# EAGLE schematic ICeePotTransmitter (EAGLE 6.3)
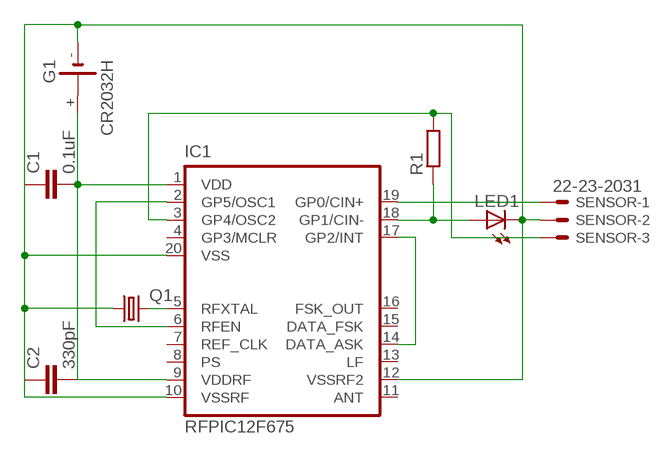
[diagram p0: schematic, sheet 1]

## Parts
C1  0.1uF  C-EUC0603K  [C0603K]
C2  330pF  C-EUC0603K  [C0603K]
G1  CR2032H  [CR2032H]
IC1  RFPIC12F675  [SOIC20]
LED1  LED5MM  [LED5MM]
Q1  CRYSTALHC49S  [HC49/S]
R1  R-EU_0204/7  [0204/7]
SENSOR  22-23-2031  [22-23-2031]

## Nets
N$1: IC1.19(GP0/CIN+) SENSOR.1
N$2: IC1.14(DATA_ASK) IC1.17(GP2/INT)
N$3: IC1.18(GP1/CIN-) LED1.A R1.1
N$4: IC1.3(GP4/OSC2) R1.2 SENSOR.3
N$5: C1.2 C2.2 G1.+ IC1.1(VDD) IC1.9(VDDRF)
N$6: IC1.5(RFXTAL) Q1.2
N$7: C1.1 C2.1 G1.- IC1.10(VSSRF) IC1.12(VSSRF2) IC1.20(VSS) LED1.K(C) Q1.1 SENSOR.2
N$8: IC1.2(GP5/OSC1) IC1.6(RFEN)
Unconnected: G1.+@1(+) IC1.4(GP3/MCLR) IC1.7(REF_CLK) IC1.8(PS) IC1.11(ANT) IC1.13(LF) IC1.15(DATA_FSK) IC1.16(FSK_OUT)

## Library data of the parts
C1 C2 = rcl:C-EU: CAPACITOR, European symbol
G1 = battery:CR2032H: LI BATTERY Varta
IC1 = rfpic:RFPIC12F675: Microchip 12F675 PIC Microcontroller with rf transmitter
LED1 = adafruit:LED: LED OSRAM: - CHIPLED LG R971, LG N971, LY N971, LG Q971, LY Q971, LO R971, LY R971 LH N974, LH R974 LS Q976, LO Q976, LY Q976 LO Q996 - Hyper CHIPLED LW Q18S LB Q993, LB Q99A, LB R99A - SideLED LS A670, LO A670, LY A670, LG A670, LP A670 LB A673, LV A673, LT A673, LW A673 LH A674 LY A675 LS A676, LA A676, LO A676, LY A676, LW A676 LS A679, LY A679, LG A679 - Hyper Micro SIDELED® LS Y876, LA Y876, LO Y876, LY Y876 LT Y87S - SmartLED LW L88C, LW L88S LB L89C, LB L89S, LG L890 LS L89K, LO L89K, LY L89K LS L896, LA L896, LO L896, LY L896 - TOPLED LS T670, LO T670, LY T670, LG T670, LP T670 LSG T670, LSP T670, LSY T670, LOP T670, LYG T670 LG T671, LOG T671, LSG T671 LB T673, LV T673, LT T673, LW T673 LH T674 LS T676, LA T676, LO T676, LY T676, LB T676, LH T676, LSB T676, LW T676 LB T67C, LV T67C, LT T67C, LS T67K, LO T67K, LY T67K, LW E67C LS E67B, LA E67B, LO E67B, LY E67B, LB E67C, LV E67C, LT E67C LW T67C LS T679, LY T679, LG T679 LS T770, LO T770, LY T770, LG T770, LP T770 LB T773, LV T773, LT T773, LW T773 LH T774 LS E675, LA E675, LY E675, LS T675 LS T776, LA T776, LO T776, LY T776, LB T776 LHGB T686 LT T68C, LB T68C - Hyper Mini TOPLED® LB M676 - Mini TOPLED Santana® LG M470 LS M47K, LO M47K, LY M47K Source: http://www.osram.convergy.de/
Q1 = crystal:CRYSTAL: CRYSTAL; OC_FARNELL: 1667008; OC_NEWARK: unknown
R1 = resistor:R-EU_: RESISTOR, European symbol
SENSOR = con-molex:22-23-2031: .100" (2.54mm) Center Header - 3 Pin; MF: MOLEX; MPN: 22-23-2031; OC_FARNELL: 1462950; OC_NEWARK: 30C0862